# EAGLE design enc_apt_1 (EAGLE 9.6.2)
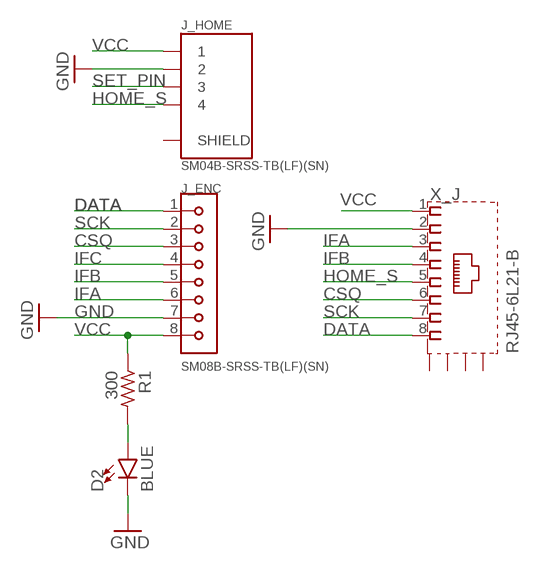
[diagram p0: schematic, sheet 1]

## Parts
D2  BLUE  LED-BLUE0603  [LED-0603]
J_ENC  SM08B-SRSS-TB(LF)(SN)  [JST_SM08B-SRSS-TB(LF)(SN)]
J_HOME  SM04B-SRSS-TB(LF)(SN)  [JST_SM04B-SRSS-TB(LF)(SN)]
R1  300  R_0603  [R0603]
X_J  RJ45-6L21-B  [RJ45-SHIELD1]

## Nets
CSQ: J_ENC.3 X_J.6
DATA: J_ENC.1 X_J.8
GND: D2.C J_ENC.7 J_HOME.2 X_J.2
HOME_S: J_HOME.4 X_J.5
IFA: J_ENC.6 X_J.3
IFB: J_ENC.5 X_J.4
IFC: J_ENC.4
N$2: D2.A R1.2
SCK: J_ENC.2 X_J.7
SET_PIN: J_HOME.3
VCC: J_ENC.8 J_HOME.1 R1.1 X_J.1
Unconnected: J_HOME.S1(SHIELD) J_HOME.S2(SHIELD) X_J.S1(S) X_J.S2(S) X_J.S3(S) X_J.S4(S)

## Library data of the parts
D2 = SparkFun-LED:LED-BLUE: Blue SMD LED Used in manufacturing of various products at SparkFun Packages: 0603 - SMD 0603 package [Product Link] <http://www.digikey.com/product-detail/en/SMLE12BC7TT86/511-1589-2-ND/1641808> 1206 - SMD1206 package [Product Link] <http://www.digikey.com/product-detail/en/lite-on-inc/LTST-C150TBKT/160-1643-1-ND/573584> SparkFun Products: ESP8266 Thing-Dev Board <https://www.sparkfun.com/products/13711> RedBoard <https://www.sparkfun.com/products/12757>; PROD_ID: DIO-08575
J_ENC = SM08B-SRSS-TB_LF__SN_:SM08B-SRSS-TB(LF)(SN): SH Series 8 Position 1 mm Pitch Surface Mount Side Entry Shrouded Header Check prices <https://pricing.snapeda.com/parts/SM08B-SRSS-TB%28LF%29%28SN%29/JST%20Sales/view-part?ref=eda>; AVAILABILITY: Warning; DESCRIPTION: Connector Header Surface Mount, Right Angle 8 position 0.039 (1.00mm); MF: JST Sales; MP: SM08B-SRSS-TB(LF)(SN); PACKAGE: None; PRICE: None
J_HOME = SM04B-SRSS-TB_LF__SN_:SM04B-SRSS-TB(LF)(SN): SH Series 1.0 mm Pitch 2 Position Single Row Side Entry Shrouded Header Check prices <https://snapeda.com/parts/SM04B-SRSS-TB%28LF%29%28SN%29/JST%20Sales/view-part/?ref=eda>; ARROW_EUROPE-PURCHASE-URL: https://snapeda.com/shop?store=Arrow+Europe&id=557466; AVAILABILITY: Good; DESCRIPTION: Connector Header Surface Mount, Right Angle 4 position 0.039 (1.00mm); DIGIKEY-PURCHASE-URL: https://snapeda.com/shop?store=DigiKey&id=557466; MF: JST Sales; MP: SM04B-SRSS-TB(LF)(SN); PACKAGE: None; PRICE: None
R1 = rc-master-smd:R_: RESISTOR
X_J = con-tycoelectronics:RJ45*2: RJ45 Low Profile Shield Type 2 For all RJ45 L, LC, LCT and X Series Models Source: www.tycoelectronics.com .. ENG_DS_1654001_1099_RJ_L_0507.pdf; OC_FARNELL: unknown; OC_NEWARK: unknown

## Board
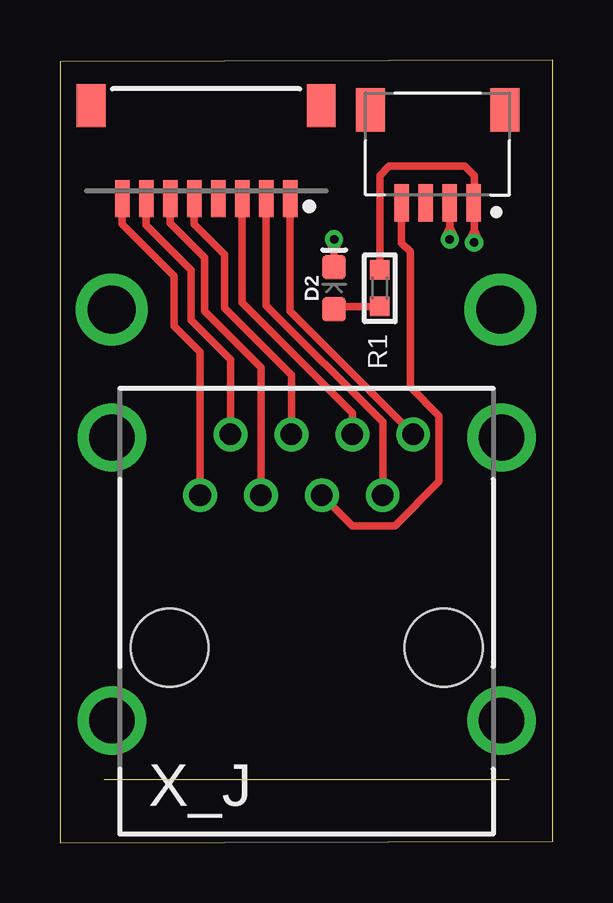
[diagram p1: board, top side]
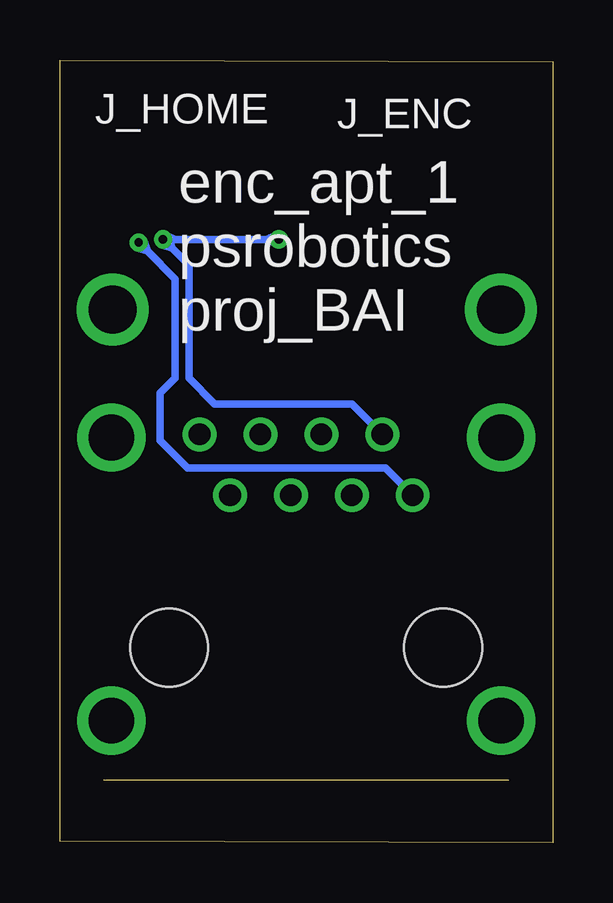
[diagram p2: board, bottom side, seen from below]

Size 20.55 x 32.63 mm. Coordinates in mm from the lower left corner, seen from the top.
Outline: 0,0 20.55,0.06 20.55,32.63 0,32.56 0,0
Copper layers (1*16): Top 0.035mm / dielectric 1.5mm / Bottom 0.035mm
Design rules "default *": minimum track width 6mil, minimum drill 0.35mm, track to track 6mil, track to pad 6mil, pad to pad 6mil, via to via 6mil, smd to smd 6mil, copper to edge 10mil, drill to drill 6mil, minimum pad ring 10mil, minimum via ring 8mil, stop-mask expansion 4mil, vias tented up to drill 16mil, thermal gap 10mil

### Footprints (pad centres in the part's own frame; a part is rotated, then mirrored left to right if it is on the bottom)
LED-0603 = smd 1 x 1: A -0.877,0; C 0.877,0
JST_SM08B-SRSS-TB(LF)(SN) = smd 0.6 x 1.55: 1 -3.5,4.775; 2 -2.5,4.775; 3 -1.5,4.775; 4 -0.5,4.775; 5 0.5,4.775; 6 1.5,4.775; 7 2.5,4.775; 8 3.5,4.775 | smd 1.2 x 1.8: P1 -4.8,0.9; P2 4.8,0.9
JST_SM04B-SRSS-TB(LF)(SN) = smd 0.6 x 1.55: 1 -1.5,0; 2 -0.5,0; 3 0.5,0; 4 1.5,0 | smd 1.2 x 1.8: S1 -2.8,-3.875; S2 2.8,-3.875
R0603 = smd 0.8 x 0.8: 1 -0.762,0; 2 0.762,0
RJ45-SHIELD1 = drill 0.9 pad 1.4: 1 -4.445,6.35; 2 -3.175,8.89; 3 -1.905,6.35; 4 -0.635,8.89; 5 0.635,6.35; 6 1.905,8.89; 7 3.175,6.35; 8 4.445,8.89 | drill 1.9 pad 2.5: S1 -8.128,-3.048; S2 8.128,-3.048; S3 -8.128,8.76; S4 8.128,8.76 | hole 3.251: -5.715,0; 5.715,0

### Placement (x,y rotation side)
D2  11.43,23.11 90 top
J_ENC  6.1,31.62 180 top
J_HOME  15.75,26.67 180 top
R1  13.34,23.11 270 top
X_J  10.29,8.13 0 top

### Tracks (layer width: path | path; a pad name or v marks a point on that pad's centre or on a via)
CSQ
  Top 0.305: J_ENC.3 7.6,22.5 12.19,17.91 X_J.6
DATA
  Top 0.305: J_ENC.1 9.6,22.15 X_J.8
GND  (via drill 0.35)
  Top 0.305: v16.26,25.15 16.26,25.67 | 16.26,25.67 J_HOME.2 | J_ENC.7 3.6,25.74 5.46,23.88 5.46,21.78 7.11,20.13 X_J.2 | D2.C 11.43,24.62 | 11.43,24.62 | 11.43,24.62 v11.43,25.15 | 16.26,25.67 | 16.26,25.67 16.05,25.24 | 16.26,25.67 16.46,25.24 | 16.46,25.24 | v16.26,25.15 16.46,25.24 | 11.43,24.62 11.63,25.05 | 11.63,25.05 | v11.43,25.15 11.63,25.05 | 11.43,24.62 11.23,25.05 | 11.23,25.05 | 16.26,25.67 | 16.26,25.67 16.05,25.24 | 16.05,25.24 | 16.26,25.67 | 16.26,25.67 16.05,25.24 | 16.05,25.24 | v16.26,25.15 16.05,25.24 | 16.26,25.67 16.46,25.24 | 16.26,25.67 16.05,25.24 | v16.26,25.15 16.05,25.24 | 16.26,25.67 16.46,25.24 | 16.46,25.24 | v16.26,25.15 16.46,25.24 | 16.26,25.67 16.05,25.24 | v16.26,25.15 16.05,25.24 | 16.26,25.67 16.46,25.24 | v16.26,25.15 16.46,25.24 | 11.43,24.62 11.63,25.05 | 11.63,25.05 | 11.43,24.62 11.63,25.05 | v11.43,25.15 11.63,25.05 | 11.43,24.62 | 11.23,25.05 | v11.43,25.15 11.23,25.05 | 11.43,24.62 11.63,25.05 | 11.43,24.62 | 11.43,24.62 11.23,25.05 | v11.43,25.15 11.23,25.05 | 11.43,24.62 11.63,25.05 | v11.43,25.15 11.63,25.05 | 11.43,24.62 11.23,25.05 | v11.43,25.15 11.23,25.05
  Bottom 0.305: X_J.2 8.38,18.29 14.1,18.29 15.18,19.37 15.18,24.07 15.88,24.77 | 15.88,24.77 v16.26,25.15 | v11.43,25.15 11.96,25.15 | 11.96,25.15 | 11.96,25.15 15.73,25.15 | 15.73,25.15 v16.26,25.15 | 15.73,25.15 | 15.73,25.15 16.16,24.94 | 15.73,25.15 16.16,25.35 | 16.16,25.35 | v16.26,25.15 16.16,25.35 | 11.96,25.15 11.53,25.35 | 11.53,25.35 | v11.43,25.15 11.53,25.35 | 11.96,25.15 11.53,24.94 | 11.53,24.94 | 15.73,25.15 | 15.73,25.15 16.16,24.94 | 16.16,24.94 | 15.73,25.15 | 15.88,24.77 16.33,24.93 v16.26,25.15 | 15.88,24.77 16.04,25.22 v16.26,25.15 | 15.73,25.15 16.16,24.94 | 16.16,24.94 | v16.26,25.15 16.16,24.94 | 15.73,25.15 16.16,25.35 | 15.73,25.15 16.16,24.94 | v16.26,25.15 16.16,24.94 | 15.73,25.15 16.16,25.35 | 16.16,25.35 | v16.26,25.15 16.16,25.35 | 15.73,25.15 16.16,24.94 | v16.26,25.15 16.16,24.94 | 15.73,25.15 16.16,25.35 | v16.26,25.15 16.16,25.35 | 11.96,25.15 11.53,25.35 | 11.53,25.35 | 11.96,25.15 11.53,25.35 | v11.43,25.15 11.53,25.35 | 11.96,25.15 | 11.53,24.94 | v11.43,25.15 11.53,24.94 | 11.96,25.15 11.53,25.35 | 11.96,25.15 | 11.96,25.15 11.53,24.94 | v11.43,25.15 11.53,24.94 | 11.96,25.15 11.53,25.35 | v11.43,25.15 11.53,25.35 | 11.96,25.15 11.53,24.94 | v11.43,25.15 11.53,24.94
HOME_S
  Top 0.305: J_HOME.4 14.25,25 14.61,24.64 14.61,18.99 15.81,17.78 15.81,15.05 13.97,13.21 12.19,13.21 X_J.5
IFA
  Top 0.305: J_ENC.6 4.6,25.82 6.03,24.38 6.03,22.16 8.38,19.81 X_J.3
IFB
  Top 0.305: J_ENC.5 5.6,25.77 6.86,24.51 6.86,22.29 9.65,19.49 X_J.4
N$1  (via drill 2)
  other vias: 2.16,22.23
N$2
  Top 0.305: D2.A 11.54,22.35 R1.2
N$3  (via drill 2)
  other vias: 18.36,22.23
SCK
  Top 0.305: J_ENC.2 8.6,22.39 13.46,17.53 X_J.7
VCC  (via drill 0.35)
  Top 0.305: v17.27,25.02 17.27,25.54 | 17.27,25.54 17.27,26.65 | 17.27,26.65 J_HOME.1 | J_ENC.8 2.6,25.79 4.76,23.62 4.76,21.53 5.84,20.45 X_J.1 | R1.1 13.34,27.81 13.72,28.19 16.89,28.19 17.27,27.81 17.27,26.65 | 17.27,25.54 | 17.27,25.54 17.07,25.12 | 17.27,25.54 17.48,25.12 | 17.48,25.12 | v17.27,25.02 17.48,25.12 | 17.27,25.54 | 17.27,25.54 17.07,25.12 | 17.07,25.12 | 17.27,25.54 | 17.27,25.54 17.07,25.12 | 17.07,25.12 | v17.27,25.02 17.07,25.12 | 17.27,25.54 17.48,25.12 | 17.27,25.54 17.07,25.12 | v17.27,25.02 17.07,25.12 | 17.27,25.54 17.48,25.12 | 17.48,25.12 | v17.27,25.02 17.48,25.12 | 17.27,25.54 17.07,25.12 | v17.27,25.02 17.07,25.12 | 17.27,25.54 17.48,25.12 | v17.27,25.02 17.48,25.12
  Bottom 0.305: X_J.1 6.99,15.62 15.24,15.62 16.38,16.76 16.38,18.73 15.75,19.37 15.75,23.5 16.9,24.65 | 16.9,24.65 v17.27,25.02 | 16.9,24.65 17.35,24.81 v17.27,25.02 | 16.9,24.65 17.06,25.09 v17.27,25.02

### Text on the board
bPlace: enc_apt_1 / psrobotics / proj_BAI